# Altium project PCB_Project.PrjPcb
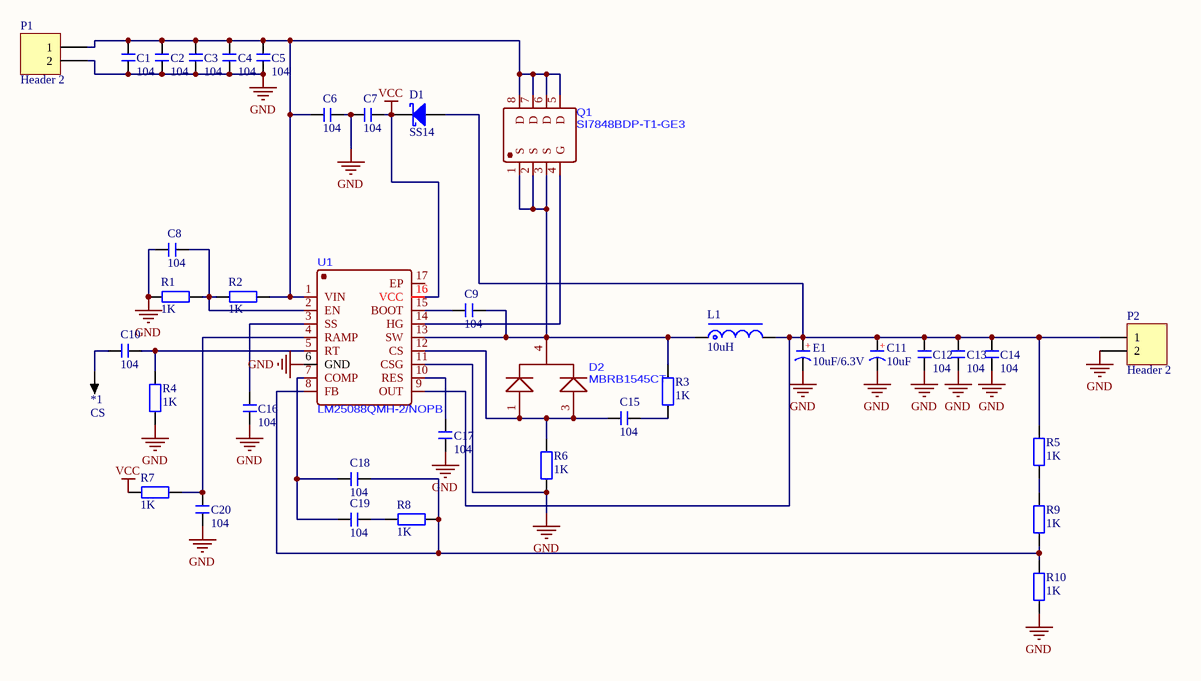
[diagram p0: Sheet1.SchDoc]
1 sheet, 39 parts. Net scope: global (net labels, ports and power ports of the same name join across sheets).
Board file: PCB1.PcbDoc

## Sheet Sheet1.SchDoc
size A4; SheetNumber: 1; SheetTotal: 1

### Parts
*1  CS  [R100]
C1  104  [C 0805_L]
C2  104  [C 0805_L]
C3  104  [C 0805_L]
C4  104  [C 0805_L]
C5  104  [C 0805_L]
C6  104  [C 0805_L]
C7  104  [C 0805_L]
C8  104  [C 0805_L]
C9  104  [C 0805_L]
C10  104  [C 0805_L]
C11  10uF  [CAP 3.5*8*11.5 - BK]
C12  104  [C 0805_L]
C13  104  [C 0805_L]
C14  104  [C 0805_L]
C15  104  [C 0805_L]
C16  104  [C 0805_L]
C17  104  [C 0805_L]
C18  104  [C 0805_L]
C19  104  [C 0805_L]
C20  104  [C 0805_L]
D1  SS14  [SMA]
D2  MBRB1545CT  [ONSC-D2PAK-3-418B-04_V]
E1  10uF/6.3V  [CS 2.0*5*8 - C]
L1  10uH  [CD31]
P1  Header 2  [HDR1X2]
P2  Header 2  [HDR1X2]
Q1  SI7848BDP-T1-GE3  [POWERPAK-SO-8_L6.1-W5.1-P1.27-BL-EP]
R1  1K  [R 0805_L]
R2  1K  [R 0805_L]
R3  1K  [R 0805_L]
R4  1K  [R 0805_L]
R5  1K  [R 0805_L]
R6  1K  [R 0805_L]
R7  1K  [R 0805_L]
R8  1K  [R 0805_L]
R9  1K  [R 0805_L]
R10  1K  [R 0805_L]
U1  LM25088QMH-2/NOPB  [HTSSOP-16_L5.0-W4.4-P0.65-LS6.4-BL-EP]

### Nets
GND: C1.1 C2.1 C3.1 C4.1 C5.1 C6.1 C7.2 C8.2 C11.2(K) C12.2 C13.2 C14.2 C16.2 C17.2 C20.2 E1.2(K) P1.2 P2.2 R1.1 R4.1 R6.1 R10.1 U1.6(GND) U1.11(CSG)
VCC: C7.1 D1.2(K) R7.1 U1.16(VCC)
Net*1_1: *1.1 C10.2
NetC1_2: C1.2 C2.2 C3.2 C4.2 C5.2 C6.2 P1.1 Q1.5(D) Q1.6(D) Q1.7(D) Q1.8(D) R2.2 U1.1(VIN)
NetC8_1: C8.1 R1.2 R2.1 U1.2(EN)
NetC9_1: C9.1 D2.4(K) L1.1 Q1.1(S) Q1.2(S) Q1.3(S) R3.2 U1.13(SW)
NetC9_2: C9.2 U1.15(BOOT)
NetC10_1: C10.1 R4.2 U1.5(RT)
NetC11_1: C11.1(A) C12.1 C13.1 C14.1 D1.1(A) E1.1(A) L1.2 P2.1 R5.2 U1.9(OUT)
NetC15_1: C15.1 R3.1
NetC15_2: C15.2 D2.1(A1) D2.3(A2) R6.2 U1.12(CS)
NetC16_1: C16.1 U1.3(SS)
NetC17_1: C17.1 U1.10(RES)
NetC18_1: C18.1 C19.1 U1.7(COMP)
NetC18_2: C18.2 R8.1 R9.1 R10.2 U1.8(FB)
NetC19_2: C19.2 R8.2
NetC20_1: C20.1 R7.2 U1.4(RAMP)
NetQ1_4: Q1.4(G) U1.14(HG)
NetR5_1: R5.1 R9.2

Not connected (* = marked no-connect by the designer): U1 17(EP)

### Notes on the sheet
- (in symbol CE) +
- (in symbol CS) +

### Library data of the parts
*1 = CS: 探针焊盘; 淘宝ID: 小糖豆的小窝窝; BOM名称: 探针焊盘; 下单链接: https://item.taobao.com/item.htm?ft=t&id=613637044352
C1-C10 C12-C20 = C: 贴片电容; 淘宝ID: 小糖豆的小窝窝; BOM名称: 贴片电容; 下单链接: https://item.taobao.com/item.htm?ft=t&id=613637044352
C11 = CE: 直插电解电容; 淘宝ID: 小糖豆的小窝窝; BOM名称: 直插电解电容; 下单链接: https://item.taobao.com/item.htm?ft=t&id=613637044352
D1 = SS14: 肖特基二极管; 淘宝ID: 小糖豆的小窝窝; BOM名称: 肖特基二极管; 下单链接: https://item.taobao.com/item.htm?ft=t&id=613637044352
E1 = CS: 直插固态电容; 淘宝ID: 小糖豆的小窝窝; BOM名称: 直插固态电容; 下单链接: https://item.taobao.com/item.htm?ft=t&id=613637044352
L1 = L-SMD: CD系列贴片线绕功率电感; 淘宝ID: 小糖豆的小窝窝; BOM名称: CD系列贴片线绕功率电感; 下单链接: https://item.taobao.com/item.htm?ft=t&id=613637044352
P1 P2 = Header 2: Header, 2-Pin; LatestRevisionDate: 17-Jul-2002; LatestRevisionNote: Re-released for DXP Platform.; Publisher: Altium Limited
R1-R10 = R: 贴片电阻; 淘宝ID: 小糖豆的小窝窝; BOM名称: 贴片电阻; 下单链接: https://item.taobao.com/item.htm?ft=t&id=613637044352